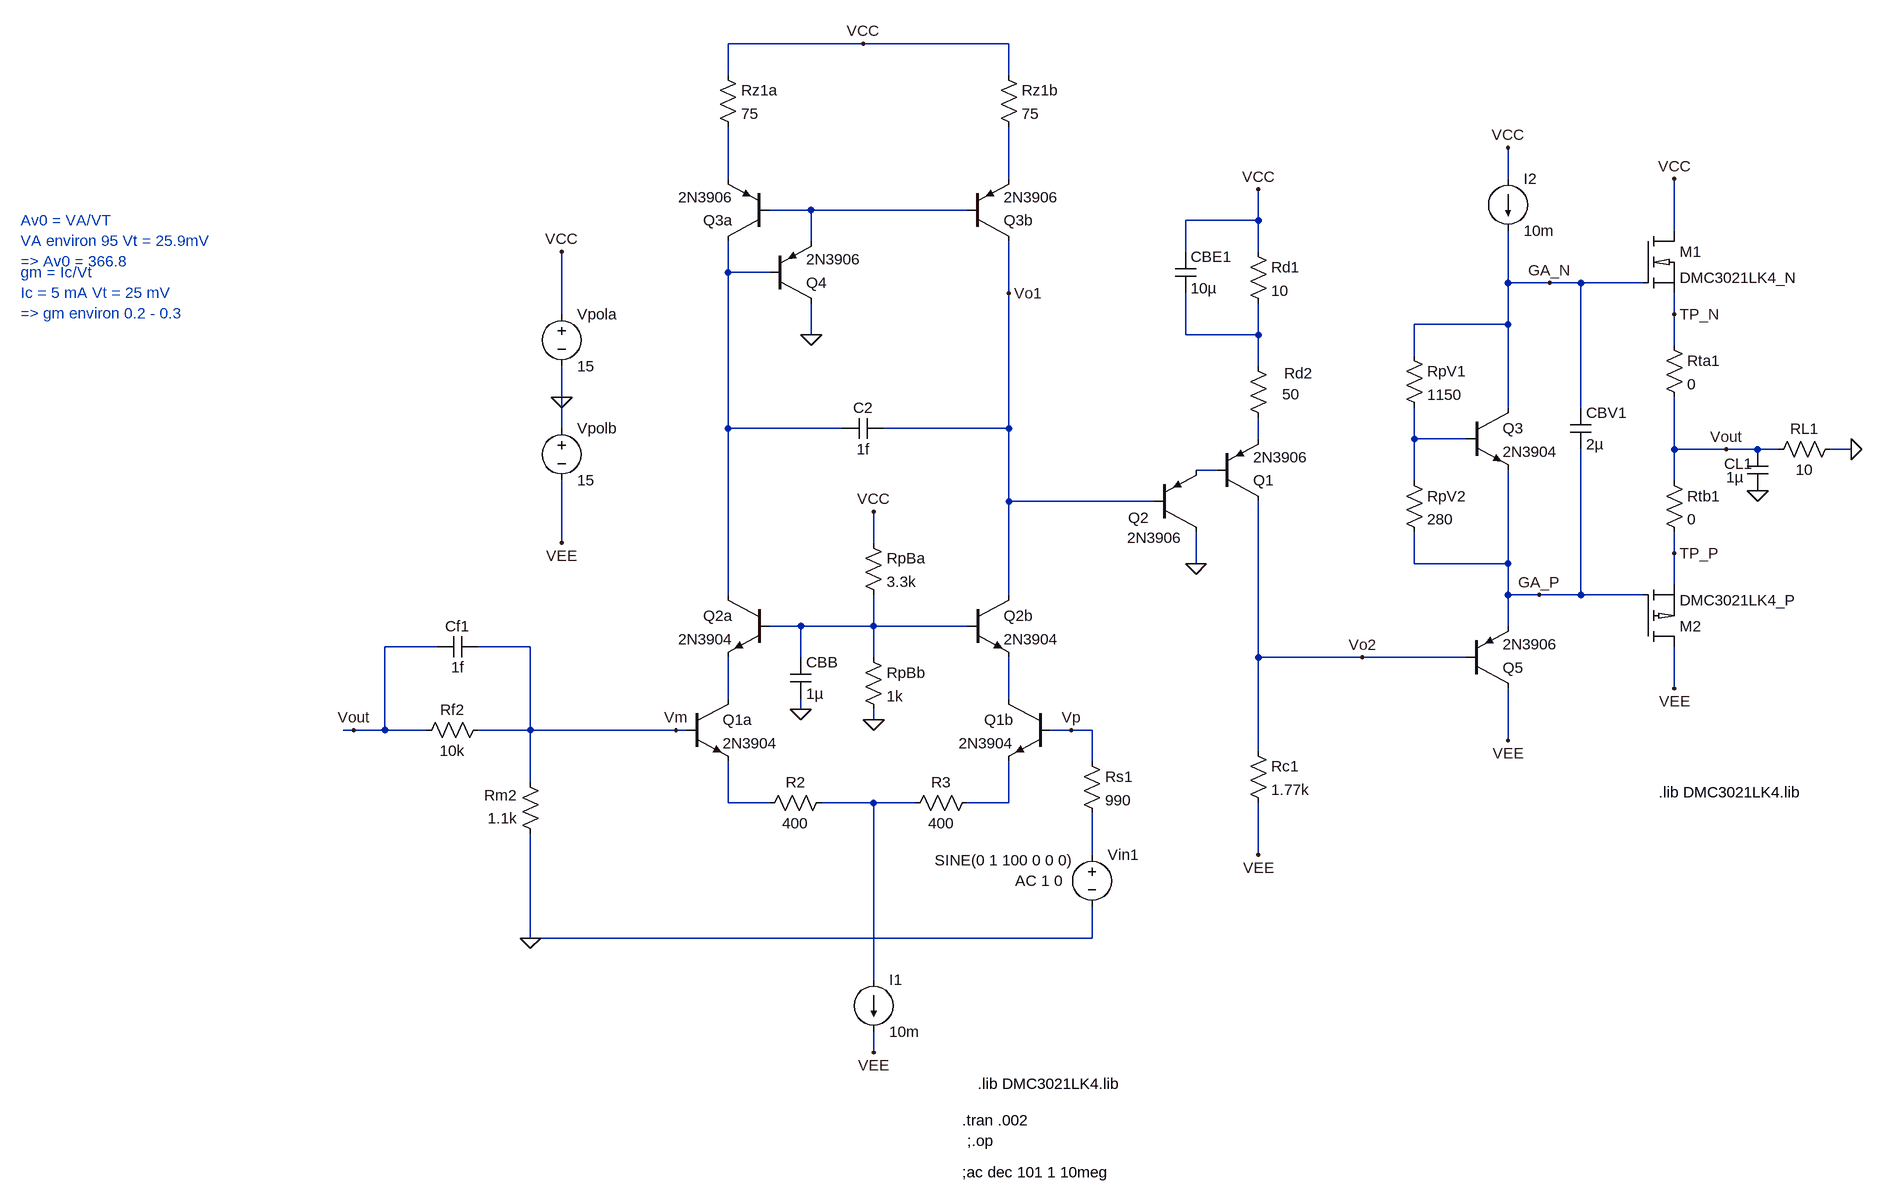
[diagram p0: schematic LT_COMPLET.asc]
LT_COMPLET.asc, the LTspice schematic file:
Version 4
SHEET 1 2404 1432
WIRE 288 -688 80 -688
WIRE 512 -688 288 -688
WIRE 80 -640 80 -688
WIRE 512 -640 512 -688
WIRE 80 -480 80 -560
WIRE 512 -480 512 -560
WIRE 1280 -480 1280 -528
WIRE 208 -432 144 -432
WIRE 448 -432 208 -432
WIRE 896 -416 896 -464
WIRE 896 -416 784 -416
WIRE 1536 -400 1536 -480
WIRE 208 -384 208 -432
WIRE 784 -368 784 -416
WIRE 896 -368 896 -416
WIRE 80 -336 80 -384
WIRE 144 -336 80 -336
WIRE 1280 -320 1280 -400
WIRE 1344 -320 1280 -320
WIRE 1392 -320 1344 -320
WIRE 1488 -320 1392 -320
WIRE 512 -304 512 -384
WIRE -176 -272 -176 -368
WIRE 1536 -272 1536 -304
WIRE 1280 -256 1280 -320
WIRE 1280 -256 1136 -256
WIRE 208 -240 208 -288
WIRE 784 -240 784 -304
WIRE 896 -240 896 -288
WIRE 896 -240 784 -240
WIRE 1536 -224 1536 -272
WIRE 1136 -208 1136 -256
WIRE 896 -192 896 -240
WIRE -176 -144 -176 -192
WIRE 1280 -128 1280 -256
WIRE 1392 -128 1392 -320
WIRE -176 -96 -176 -144
WIRE 80 -96 80 -336
WIRE 256 -96 80 -96
WIRE 512 -96 512 -304
WIRE 512 -96 320 -96
WIRE 896 -80 896 -112
WIRE 1136 -80 1136 -128
WIRE 1216 -80 1136 -80
WIRE 1536 -64 1536 -144
WIRE 1616 -64 1536 -64
WIRE 1664 -64 1616 -64
WIRE 1696 -64 1664 -64
WIRE 1808 -64 1776 -64
WIRE 832 -32 800 -32
WIRE 1136 -16 1136 -80
WIRE 1536 -16 1536 -64
WIRE 512 16 512 -96
WIRE 736 16 512 16
WIRE -176 80 -176 -16
WIRE 304 80 304 32
WIRE 1536 96 1536 64
WIRE 800 112 800 64
WIRE 1136 112 1136 64
WIRE 1280 112 1280 -32
WIRE 1280 112 1136 112
WIRE 1536 144 1536 96
WIRE 80 160 80 -96
WIRE 512 160 512 16
WIRE 1280 160 1280 112
WIRE 1328 160 1280 160
WIRE 1392 160 1392 -64
WIRE 1392 160 1328 160
WIRE 1488 160 1392 160
WIRE 192 208 144 208
WIRE 304 208 304 160
WIRE 304 208 192 208
WIRE 448 208 304 208
WIRE 1280 208 1280 160
WIRE -368 240 -448 240
WIRE -224 240 -304 240
WIRE 192 256 192 208
WIRE 304 256 304 208
WIRE 896 256 896 16
WIRE 1056 256 896 256
WIRE 1216 256 1056 256
WIRE 1536 304 1536 240
WIRE 80 320 80 256
WIRE 512 320 512 256
WIRE 192 336 192 320
WIRE 304 352 304 336
WIRE -496 368 -512 368
WIRE -448 368 -448 240
WIRE -448 368 -496 368
WIRE -384 368 -448 368
WIRE -224 368 -224 240
WIRE -224 368 -304 368
WIRE 0 368 -224 368
WIRE 16 368 0 368
WIRE 608 368 576 368
WIRE 640 368 608 368
WIRE 1280 384 1280 304
WIRE 896 400 896 256
WIRE 640 416 640 368
WIRE -224 448 -224 368
WIRE 80 480 80 416
WIRE 144 480 80 480
WIRE 304 480 224 480
WIRE 368 480 304 480
WIRE 512 480 512 416
WIRE 512 480 448 480
WIRE 640 560 640 496
WIRE 896 560 896 480
WIRE -224 688 -224 528
WIRE 640 688 640 640
WIRE 640 688 -224 688
WIRE 304 752 304 480
WIRE 304 864 304 832
FLAG 288 -688 VCC
FLAG -176 -368 VCC
FLAG -176 80 VEE
FLAG -176 -144 0
FLAG 512 -304 Vo1
FLAG 608 368 Vp
FLAG 208 -240 0
FLAG 304 864 VEE
FLAG 0 368 Vm
FLAG 304 352 0
FLAG 304 32 VCC
FLAG 192 336 0
FLAG 896 -464 VCC
FLAG 800 112 0
FLAG 896 560 VEE
FLAG 1808 -64 0
FLAG 1536 -480 VCC
FLAG 1536 304 VEE
FLAG 1280 384 VEE
FLAG 1344 -320 GA_N
FLAG 1328 160 GA_P
FLAG 1616 -64 Vout
FLAG 1536 -272 TP_N
FLAG 1536 96 TP_P
FLAG 1664 0 0
FLAG 1280 -528 VCC
FLAG 1056 256 Vo2
FLAG -496 368 Vout
FLAG -224 688 0
SYMBOL npn 16 320 R0
SYMATTR InstName Q1a
SYMATTR Value 2N3904
SYMBOL npn 576 320 M0
SYMATTR InstName Q1b
SYMATTR Value 2N3904
SYMBOL npn 448 160 R0
SYMATTR InstName Q2b
SYMATTR Value 2N3904
SYMBOL npn 144 160 M0
SYMATTR InstName Q2a
SYMATTR Value 2N3904
SYMBOL pnp 144 -384 R180
SYMATTR InstName Q3a
SYMATTR Value 2N3906
SYMBOL pnp 144 -288 M180
SYMATTR InstName Q4
SYMATTR Value 2N3906
SYMBOL pnp 448 -384 M180
SYMATTR InstName Q3b
SYMATTR Value 2N3906
SYMBOL res 64 -656 R0
SYMATTR InstName Rz1a
SYMATTR Value 75
SYMBOL res 496 -656 R0
SYMATTR InstName Rz1b
SYMATTR Value 75
SYMBOL voltage -176 -288 R0
WINDOW 123 0 0 Left 0
WINDOW 39 0 0 Left 0
SYMATTR InstName Vpola
SYMATTR Value 15
SYMBOL voltage -176 -112 R0
WINDOW 123 0 0 Left 0
WINDOW 39 0 0 Left 0
SYMATTR InstName Vpolb
SYMATTR Value 15
SYMBOL current 304 752 R0
WINDOW 123 0 0 Left 0
WINDOW 39 0 0 Left 0
SYMATTR InstName I1
SYMATTR Value 10m
SYMBOL res 240 464 R90
WINDOW 0 0 56 VBottom 2
WINDOW 3 32 56 VTop 2
SYMATTR InstName R2
SYMATTR Value 400
SYMBOL res 464 464 R90
WINDOW 0 0 56 VBottom 2
WINDOW 3 32 56 VTop 2
SYMATTR InstName R3
SYMATTR Value 400
SYMBOL res 288 240 R0
SYMATTR InstName RpBb
SYMATTR Value 1k
SYMBOL res 288 64 R0
SYMATTR InstName RpBa
SYMATTR Value 3.3k
SYMBOL cap 176 256 R0
SYMATTR InstName CBB
SYMATTR Value 1µ
SYMBOL pnp 832 16 M180
SYMATTR InstName Q1
SYMATTR Value 2N3906
SYMBOL pnp 736 64 M180
WINDOW 0 -40 23 Left 2
WINDOW 3 -42 -8 Left 2
SYMATTR InstName Q2
SYMATTR Value 2N3906
SYMBOL cap 768 -368 R0
SYMATTR InstName CBE1
SYMATTR Value 10µ
SYMBOL res 880 -384 R0
SYMATTR InstName Rd1
SYMATTR Value 10
SYMBOL res 880 -208 R0
WINDOW 0 56 27 Left 2
WINDOW 3 53 59 Left 2
SYMATTR InstName Rd2
SYMATTR Value 50
SYMBOL res 880 384 R0
SYMATTR InstName Rc1
SYMATTR Value 1.77k
SYMBOL res 1520 -240 R0
SYMATTR InstName Rta1
SYMATTR Value 0
SYMBOL res 1520 -32 R0
SYMATTR InstName Rtb1
SYMATTR Value 0
SYMBOL res 1792 -80 R90
WINDOW 0 0 56 VBottom 2
WINDOW 3 32 56 VTop 2
SYMATTR InstName RL1
SYMATTR Value 10
SYMBOL npn 1216 -128 R0
SYMATTR InstName Q3
SYMATTR Value 2N3904
SYMBOL res 1120 -224 R0
SYMATTR InstName RpV1
SYMATTR Value 1150
SYMBOL res 1120 -32 R0
SYMATTR InstName RpV2
SYMATTR Value 280
SYMBOL pnp 1216 304 M180
SYMATTR InstName Q5
SYMATTR Value 2N3906
SYMBOL cap 1376 -128 R0
SYMATTR InstName CBV1
SYMATTR Value 2µ
SYMBOL cap 1648 -64 R0
WINDOW 0 -35 22 Left 2
WINDOW 3 -32 43 Left 2
SYMATTR InstName CL1
SYMATTR Value 1µ
SYMBOL nmos_3021 1488 -400 R0
SYMATTR InstName M1
SYMBOL pmos_3021 1488 240 M180
SYMATTR InstName M2
SYMBOL current 1280 -480 R0
WINDOW 123 0 0 Left 0
WINDOW 39 0 0 Left 0
SYMATTR InstName I2
SYMATTR Value 10m
SYMBOL cap 320 -112 R90
WINDOW 0 0 32 VBottom 2
WINDOW 3 32 32 VTop 2
SYMATTR InstName C2
SYMATTR Value 1f
SYMBOL res -288 352 R90
WINDOW 0 0 56 VBottom 2
WINDOW 3 32 56 VTop 2
SYMATTR InstName Rf2
SYMATTR Value 10k
SYMBOL res -208 544 R180
WINDOW 0 36 76 Left 2
WINDOW 3 36 40 Left 2
SYMATTR InstName Rm2
SYMATTR Value 1.1k
SYMBOL cap -304 224 R90
WINDOW 0 0 32 VBottom 2
WINDOW 3 32 32 VTop 2
SYMATTR InstName Cf1
SYMATTR Value 1f
SYMBOL voltage 640 544 R0
WINDOW 123 -118 56 Left 2
WINDOW 39 0 0 Left 0
WINDOW 3 -242 24 Left 2
SYMATTR Value2 AC 1 0
SYMATTR Value SINE(0 1 100 0 0 0)
SYMATTR InstName Vin1
SYMBOL res 624 400 R0
SYMATTR InstName Rs1
SYMATTR Value 990
TEXT 448 1000 Left 2 !;.op
TEXT 440 1048 Left 2 !;ac dec 101 1 10meg
TEXT 440 968 Left 2 !.tran .002
TEXT 464 912 Left 2 !.lib DMC3021LK4.lib
TEXT -1008 -416 Left 2 ;Av0 = VA/VT \nVA environ 95 Vt = 25.9mV \n=> Av0 = 366.8
TEXT -1008 -336 Left 2 ;gm = Ic/Vt  \nIc = 5 mA Vt = 25 mV \n=> gm environ 0.2 - 0.3
TEXT 1512 464 Left 2 !.lib DMC3021LK4.lib

The netlist it stands for:
* LT_COMPLET.asc
Q1a N010 Vm N012 0 2N3904
Q1b N011 Vp N014 0 2N3904
Q2b Vo1 N009 N011 0 2N3904
Q2a N004 N009 N010 0 2N3904
Q3a N004 N003 N001 0 2N3906
Q4 0 N004 N003 0 2N3906
Q3b Vo1 N003 N002 0 2N3906
Rz1a VCC N001 75
Rz1b VCC N002 75
Vpola VCC 0 15
Vpolb 0 VEE 15
I1 N013 VEE 10m
R2 N013 N012 400
R3 N014 N013 400
RpBb N009 0 1k
RpBa VCC N009 3.3k
CBB N009 0 1µ
Q1 Vo2 N008 N006 0 2N3906
Q2 0 Vo1 N008 0 2N3906
CBE1 VCC N005 10µ
Rd1 VCC N005 10
Rd2 N005 N006 50
Rc1 Vo2 VEE 1.77k
Rta1 TP_N Vout 0
Rtb1 Vout TP_P 0
RL1 0 Vout 10
Q3 GA_N N007 GA_P 0 2N3904
RpV1 GA_N N007 1150
RpV2 N007 GA_P 280
Q5 VEE Vo2 GA_P 0 2N3906
CBV1 GA_N GA_P 2µ
CL1 Vout 0 1µ
XM1 VCC GA_N TP_N DMC3021LK4_N  ; pins D G S
XM2 VEE GA_P TP_P DMC3021LK4_P  ; pins D G S
I2 VCC GA_N 10m
C2 Vo1 N004 1f
Rf2 Vm Vout 10k
Rm2 0 Vm 1.1k
Cf1 Vm Vout 1f
Vin1 N015 0 SINE(0 1 100 0 0 0) AC 1 0
Rs1 Vp N015 990
.model NPN NPN
.model PNP PNP
.lib standard.bjt
;.op
;ac dec 101 1 10meg
.tran .002
.lib DMC3021LK4.lib
* Av0 = VA/VT
* VA environ 95 Vt = 25.9mV
* => Av0 = 366.8
* gm = Ic/Vt
* Ic = 5 mA Vt = 25 mV
* => gm environ 0.2 - 0.3
.lib DMC3021LK4.lib
.lib DMC3021LK4.lib
.backanno
.end